# EAGLE design Keg Cop - RJ45 - 6-Pack (EAGLE 9.5.2)
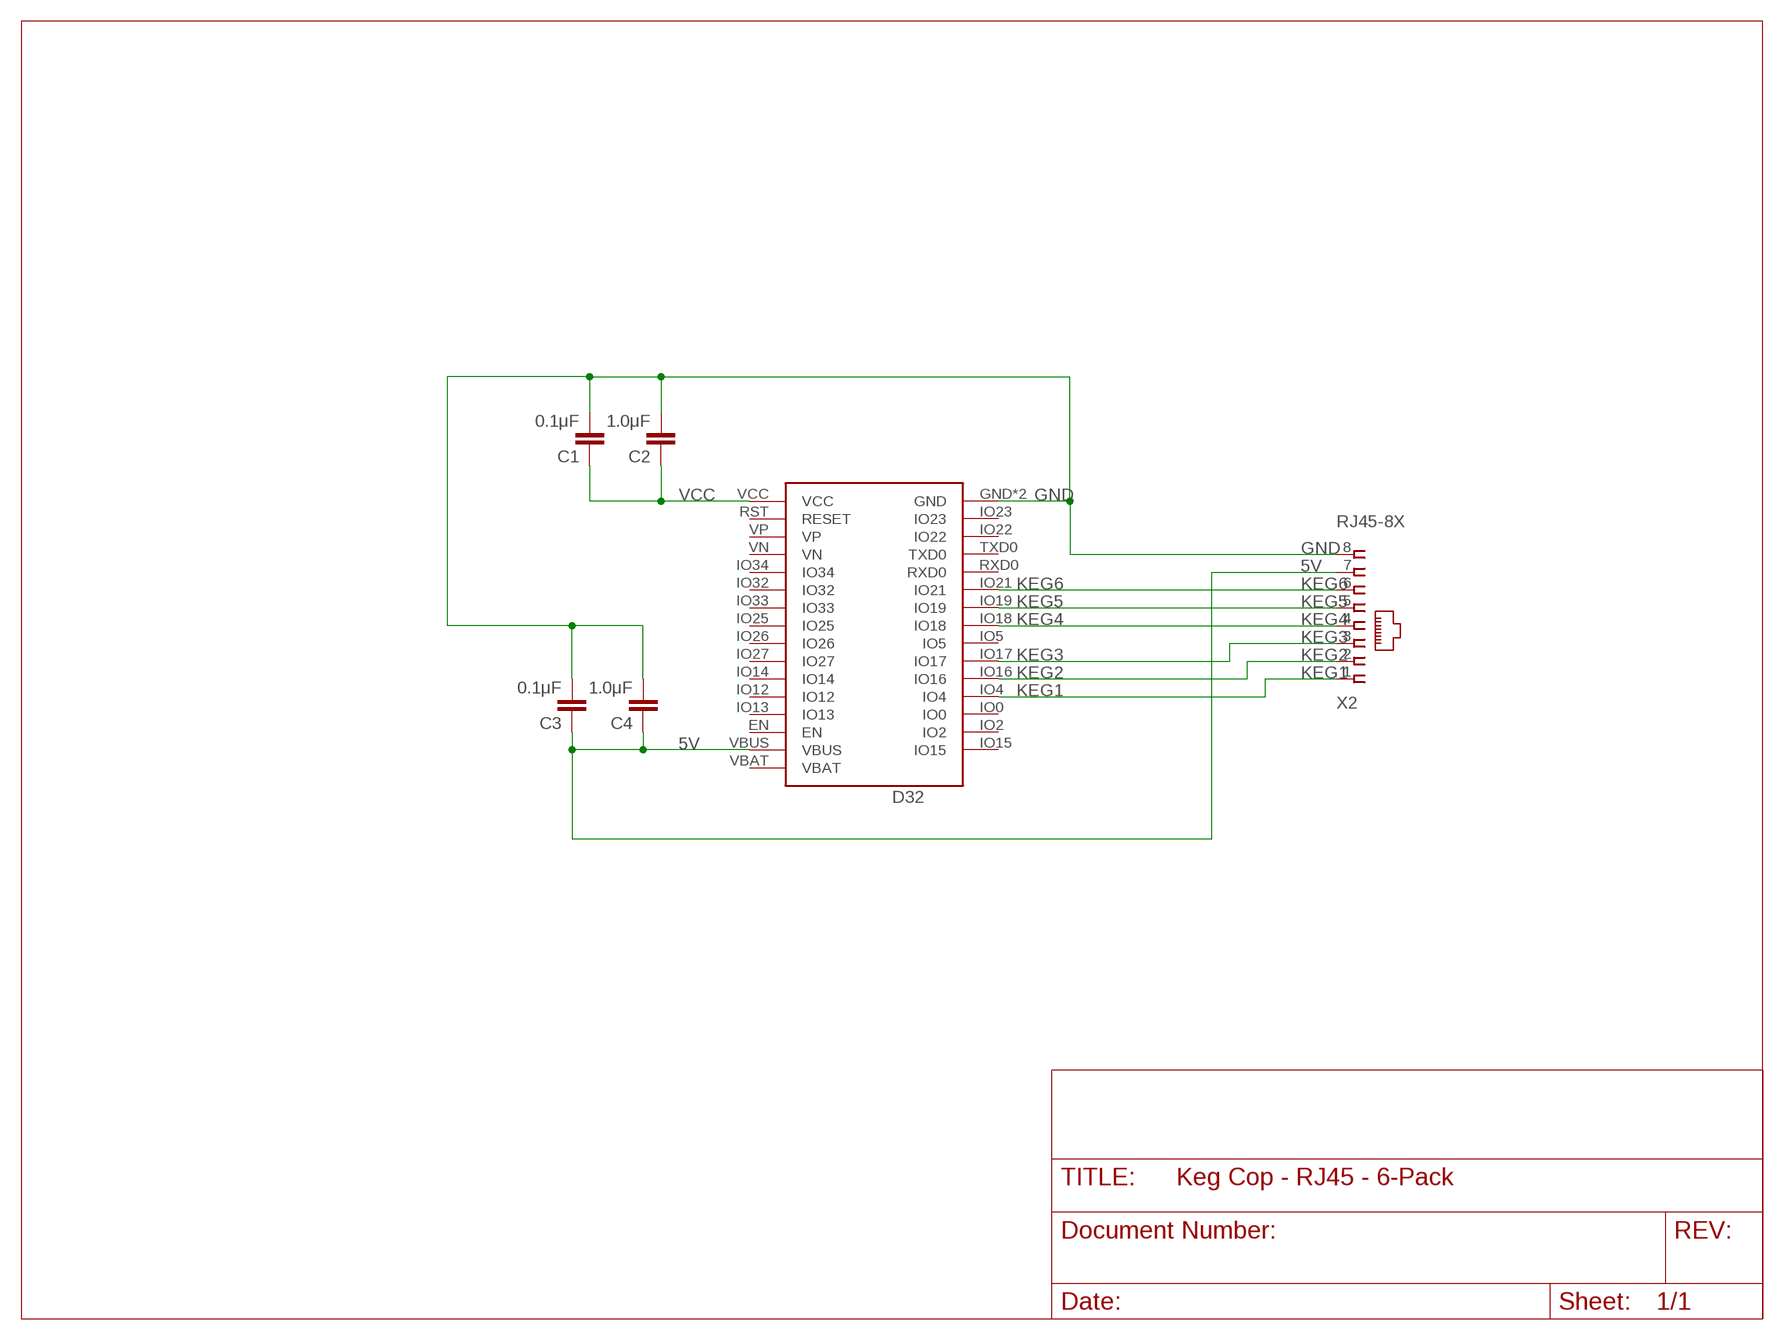
[diagram p0: schematic, sheet 1]

## Parts
C1  0.1μF  CAP_CERAMIC_2.54  [CAP_PTH-2.54]
C2  1.0μF  CAP_CERAMIC_2.54  [CAP_PTH-2.54]
C3  0.1μF  CAP_CERAMIC_2.54  [CAP_PTH-2.54]
C4  1.0μF  CAP_CERAMIC_2.54  [CAP_PTH-2.54]
D32  Lolin D32  WEMOS-D32D32_NO_BATT  [D32_NO_BATT]
X2  RJ45-8X  [RJ45-NO-SHIELD]

## Nets
5V [5v]: C3.1 C4.1 D32.VBUS X2.7
GND: C1.2 C2.2 C3.2 C4.2 D32.GND D32.GND2(GND) X2.8
KEG1: D32.IO4 X2.1
KEG2: D32.IO16 X2.2
KEG3: D32.IO17 X2.3
KEG4: D32.IO18 X2.4
KEG5: D32.IO19 X2.5
KEG6: D32.IO21 X2.6
VCC [3v]: C1.1 C2.1 D32.VCC
Unconnected: D32.EN D32.IO0 D32.IO2 D32.IO5 D32.IO12 D32.IO13 D32.IO14 D32.IO15 D32.IO22 D32.IO23 D32.IO25 D32.IO26 D32.IO27 D32.IO32 D32.IO33 D32.IO34 D32.RST(RESET) D32.RXD0 D32.TXD0 D32.VBAT D32.VN D32.VP

## Library data of the parts
C1-C4 = Donnie:CAP_CERAMIC_2.54
D32 = Donnie:WEMOS-D32: D32_REVERSE is a Reverse silkscreen for placing the Wemos D32 on the underside of the board D32_NO-KEEPOUT removes the keepout area beneath the antenna on the D32 and provides a note to avoid components and traces.
X2 = con-tycoelectronics:RJ45: CORCOM Modular RJ Jacks No Shield Source: www.tycoelectronics.com .. ENG_DS_1654001_1099_RJ_L_0507.pdf; MPN: RJ45-8X; OC_FARNELL: unknown; OC_NEWARK: 16R6101

## Net classes
0 default: width 0.305 mm, clearance 0.305 mm
1 5v: width 0.406 mm, clearance 0.406 mm
2 3v: width 0.406 mm, clearance 0.406 mm

## Board
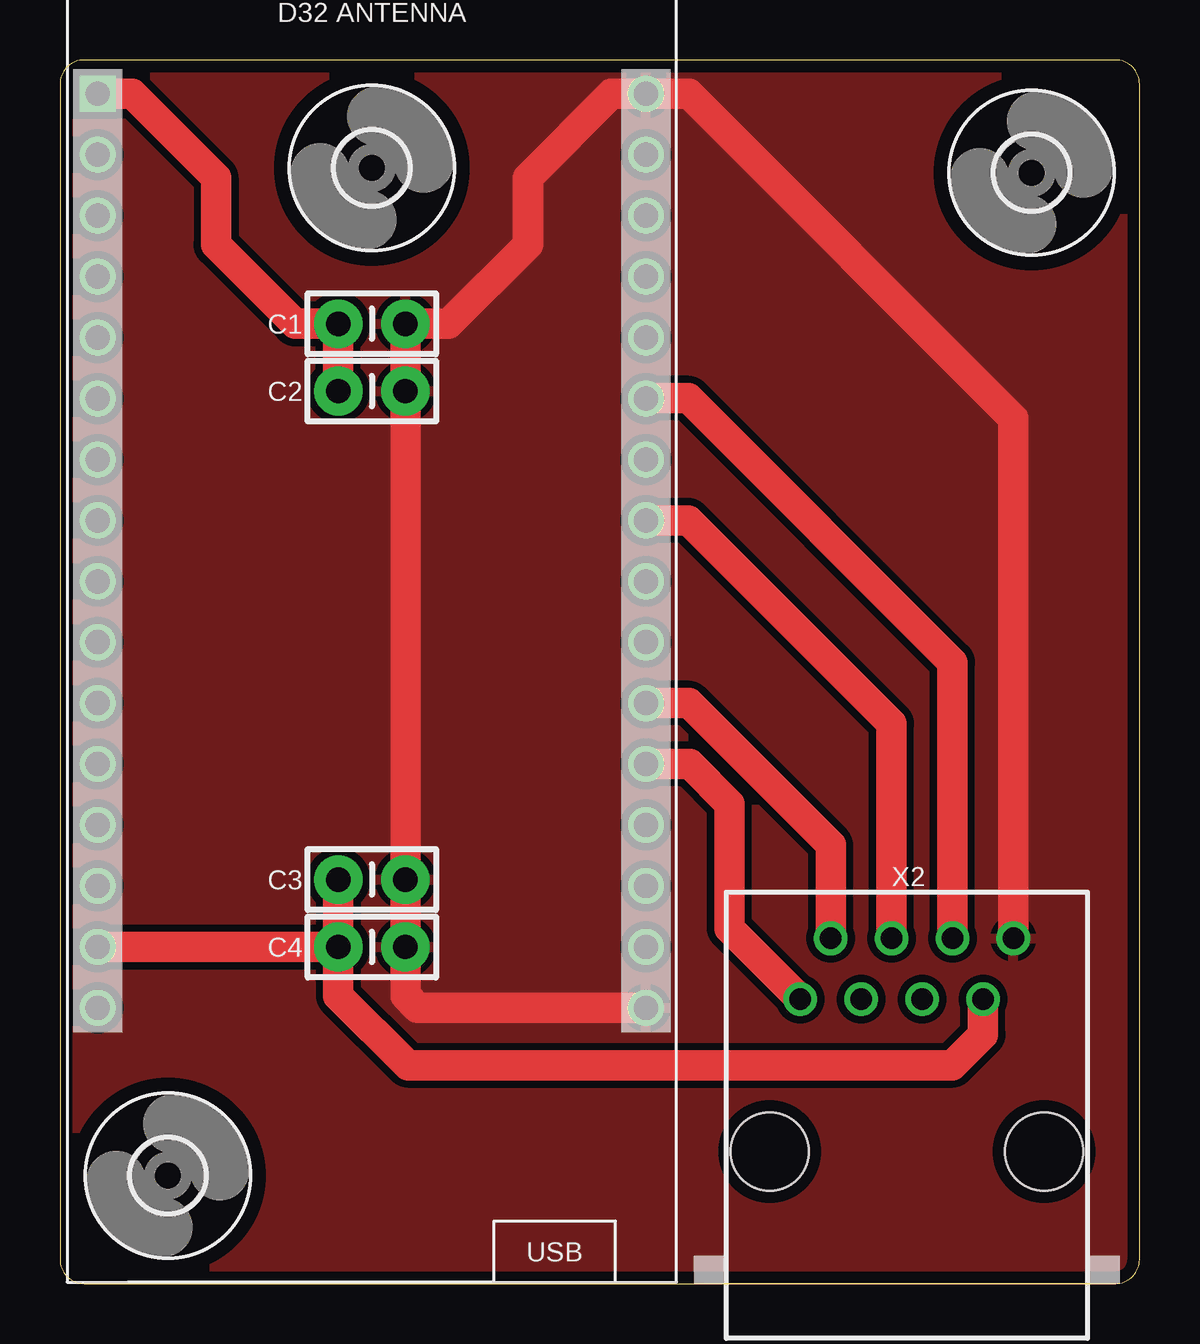
[diagram p1: board, top side]
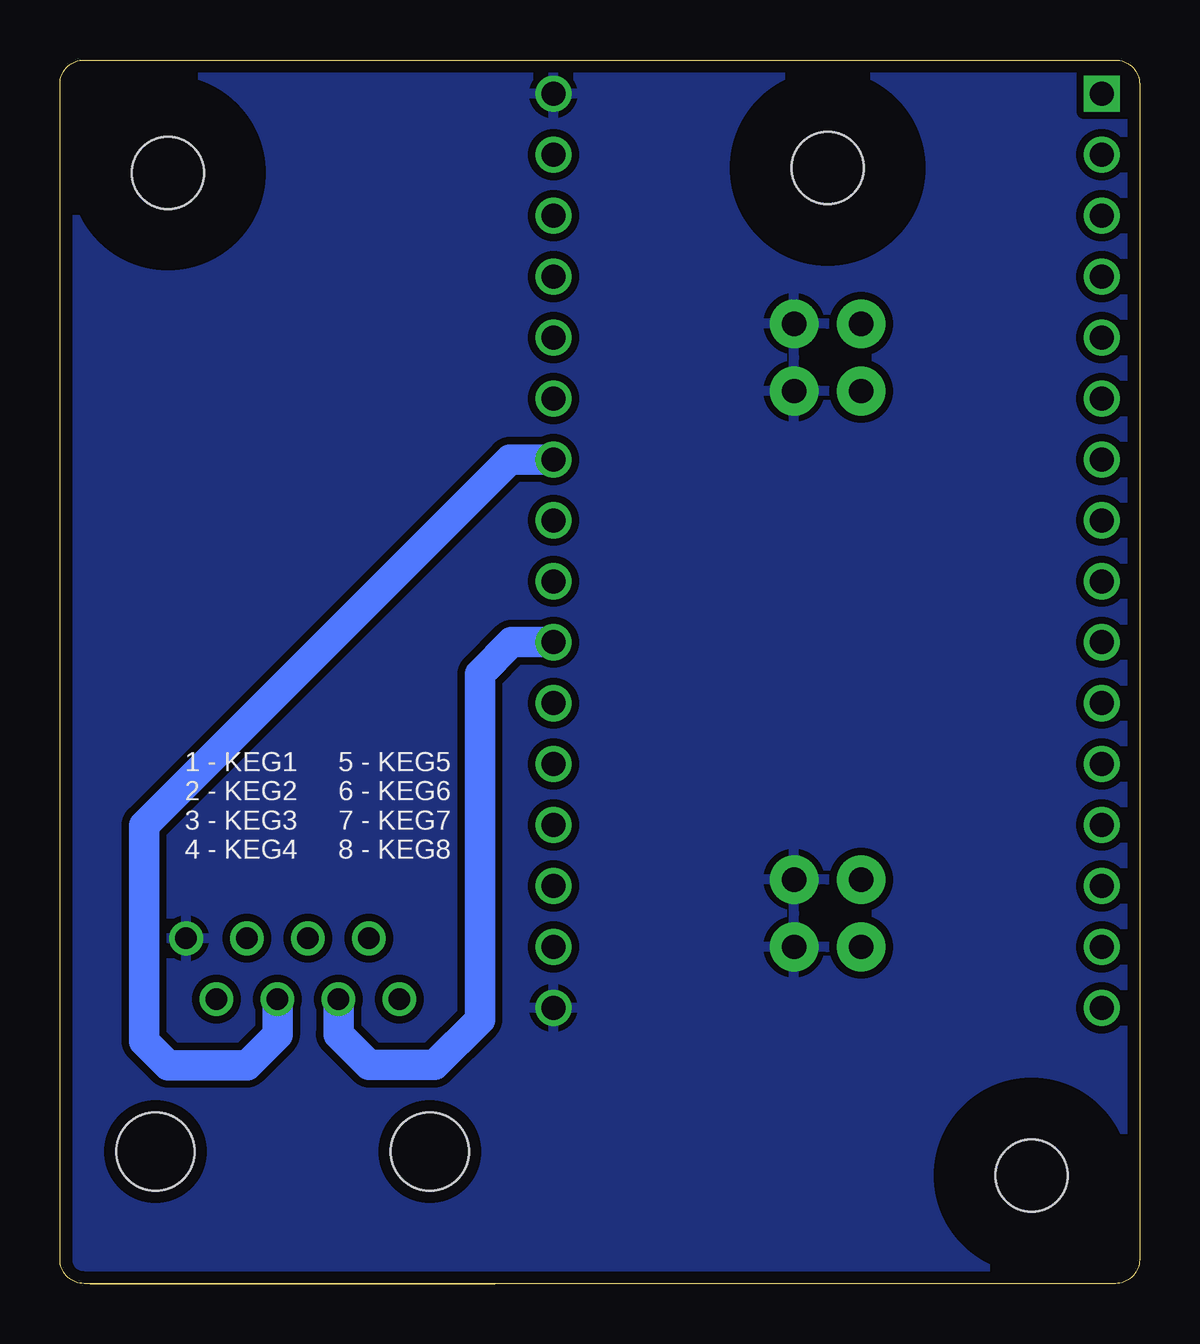
[diagram p2: board, bottom side, seen from below]

Size 45 x 51.01 mm. Coordinates in mm from the lower left corner, seen from the top.
Outline: 0,50.01 0,1.01 arc90 1,0.01 44,0.01 arc90 45,1.01 45,50.01 arc90 44,51.01 1,51.01 arc90 0,50.01
Copper layers (1*16): Top 0.035mm / dielectric 1.5mm / Bottom 0.035mm
Design rules "default *": minimum track width 6mil, minimum drill 0.35mm, track to track 6mil, track to pad 6mil, pad to pad 6mil, via to via 6mil, smd to smd 6mil, copper to edge 20mil, drill to drill 6mil, minimum pad ring 10mil, minimum via ring 8mil, stop-mask expansion 4mil, vias tented up to drill 20mil, thermal gap 10mil

### Footprints (pad centres in the part's own frame; a part is rotated, then mirrored left to right if it is on the bottom)
CAP_PTH-2.54 = drill 1.016 pad 2.032: 1 -1.397,0; 2 1.397,0
D32_NO_BATT = drill 1: EN -11.43,-12.7; GND 11.43,20.32; GND2 11.43,-17.78; IO0 11.43,-10.16; IO2 11.43,-12.7; IO4 11.43,-7.62; IO5 11.43,0; IO12 -11.43,-7.62; IO13 -11.43,-10.16; IO14 -11.43,-5.08; IO15 11.43,-15.24; IO16 11.43,-5.08; IO17 11.43,-2.54; IO18 11.43,2.54; IO19 11.43,5.08; IO21 11.43,7.62; IO22 11.43,15.24; IO23 11.43,17.78; IO25 -11.43,2.54; IO26 -11.43,0; IO27 -11.43,-2.54; IO32 -11.43,7.62; IO33 -11.43,5.08; IO34 -11.43,10.16; RST -11.43,17.78; RXD0 11.43,10.16; TXD0 11.43,12.7; VBAT -11.43,-17.78; VBUS -11.43,-15.24; VN -11.43,12.7; VP -11.43,15.24 | drill 1 square: VCC -11.43,20.32
3,0 = hole 3: 0,0
RJ45-NO-SHIELD = drill 0.9 pad 1.4: 1 -4.445,6.35; 2 -3.175,8.89; 3 -1.905,6.35; 4 -0.635,8.89; 5 0.635,6.35; 6 1.905,8.89; 7 3.175,6.35; 8 4.445,8.89 | hole 3.251: -5.715,0; 5.715,0

### Placement (x,y rotation side)
C1  13,40.01 0 top
C2  13,37.21 0 top
C3  13,16.85 0 top
C4  13,14.04 0 top
D32  13,29.28 0 top
U$1  [3,0]  4.5,4.51 0 top
U$2  [3,0]  13,46.51 0 top
U$3  [3,0]  40.5,46.31 0 top
X2  35.3,5.51 0 top

### Tracks (layer width: path | path; a pad name or v marks a point on that pad's centre or on a via)
5V
  Top 1.27: D32.VBUS C4.1 | C3.1 C4.1 | C4.1 11.6,12.01 14.5,9.11 37.2,9.11 38.48,10.39 X2.7
GND
  Top 1.27: D32.GND2 14.91,11.5 14.4,12.01 C4.2 C3.2 C2.2 C1.2 16.2,40.01 19.5,43.31 19.5,46.11 22.99,49.6 D32.GND 26.21,49.6 39.74,36.07 X2.8
  pour Top: -0.2,51.21 45.3,51.21 45.3,-0.19 -0.2,-0.19
  pour Bottom: 45.2,51.21 -0.3,51.21 -0.3,-0.19 45.3,-0.19 45.3,51.21
KEG1
  Top 1.27: X2.1 27.9,14.82 27.9,20.01 26.25,21.66 D32.IO4
KEG2
  Top 1.27: X2.2 32.12,18.29 26.21,24.2 D32.IO16
KEG3
  Bottom 1.27: X2.3 33.4,10.41 32.1,9.12 29.39,9.12 27.5,11.01 27.5,25.41 26.17,26.74 D32.IO17
KEG4
  Top 1.27: X2.4 34.66,23.35 26.19,31.82 D32.IO18
KEG5
  Bottom 1.27: X2.5 35.94,10.38 37.2,9.11 40.5,9.11 41.5,10.11 41.5,19.11 26.25,34.36 D32.IO19
KEG6
  Top 1.27: X2.6 37.2,25.91 26.2,36.91 D32.IO21
VCC
  Top 1.27: C2.1 C1.1 9.8,40.01 6.5,43.31 6.5,46.11 3.01,49.6 D32.VCC

### Text on the board
bNames: 5 - KEG5 / 6 - KEG6 / 7 - KEG7 / 8 - KEG8 | 1 - KEG1 / 2 - KEG2 / 3 - KEG3 / 4 - KEG4